# EAGLE design LoRa GPS Track v1.2 (EAGLE 7.5.0)

## Sheet 1 of 3
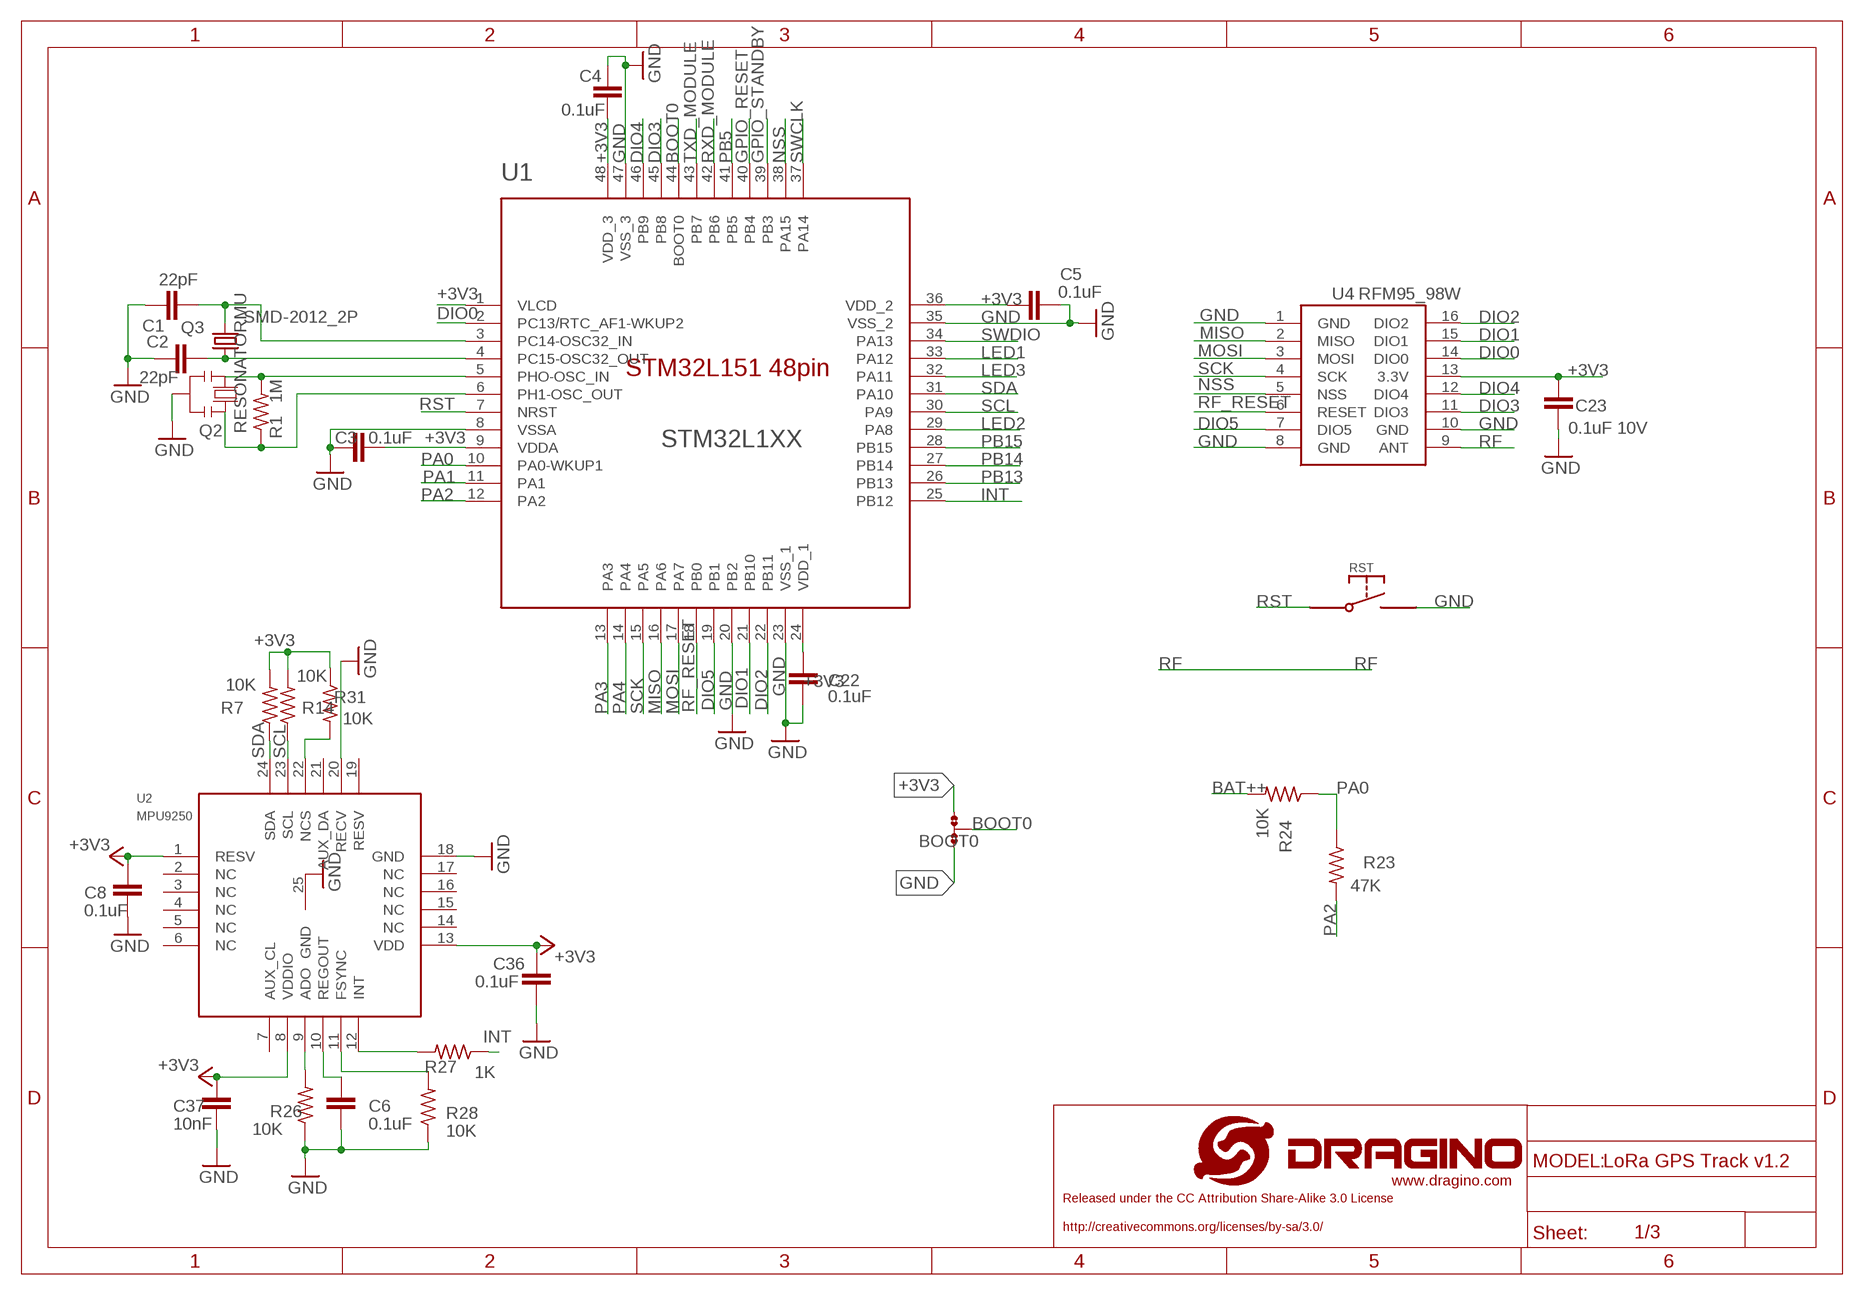
[diagram p0: schematic, sheet 1]

### Parts
BOOT0  0R-JUMPA0R-JMP-0402  [A0R-JMP-0402]
C1  22pF  C-EUC0402  [C0402]
C2  22pF  C-EUC0402  [C0402]
C3  0.1uF  C-EUC0402  [C0402]
C4  0.1uF  C-EUC0402  [C0402]
C5  0.1uF  C-EUC0402  [C0402]
C6  0.1uF  C-EUC0402  [C0402]
C8  0.1uF  C-EUC0402  [C0402]
C22  0.1uF  C-EUC0402  [C0402]
C23  0.1uF 10V  C-EUC0402  [C0402]
C36  0.1uF  C-EUC0402  [C0402]
C37  10nF  C-EUC0402  [C0402]
Q2  RESONATORMU  [RESONATOR]
Q3  SMD-2012_2P  [32.768K]
R1  1M  R-US_R0402  [R0402]
R7  10K  R-US_R0402  [R0402]
R14  10K  R-US_R0402  [R0402]
R23  47K  R-US_R0402  [R0402]
R24  10K  R-US_R0402  [R0402]
R26  10K  R-US_R0402  [R0402]
R27  1K  R-US_R0402  [R0402]
R28  10K  R-US_R0402  [R0402]
R31  10K  R-US_R0402  [R0402]
RST  SWITCHTS-017  [TS-017]
U1  STM32L1XX  [STM32L1XX]
U2  MPU9250  [QFN-24]
U4  RFM95_98W  [RFM95_98W]

### Nets
+3V3: BOOT0.1 C3.1 C4.1 C5.2 C8.2 C22.2 C23.2 C36.2 C37.2 R7.2 R14.2 R31.1 U1.1(VLCD) U1.9(VDDA) U1.24(VDD_1) U1.36(VDD_2) U1.48(VDD_3) U2.1(RESV) U2.8(VDDIO) U2.13(VDD) U4.13(3.3V) ; also sheet 2,3
BAT++: R24.2 ; also sheet 2,3
BOOT0: BOOT0.2 U1.44(BOOT0)
DIO0: U1.2(PC13/RTC_AF1-WKUP2) U4.14(DIO0)
DIO1: U1.21(PB10) U4.15(DIO1)
DIO2: U1.22(PB11) U4.16(DIO2)
DIO3: U1.45(PB8) U4.11(DIO3)
DIO4: U1.46(PB9) U4.12(DIO4)
DIO5: U1.19(PB1) U4.7(DIO5)
GND [gnd]: BOOT0.3 C1.1 C2.1 C3.2 C4.2 C5.1 C6.1 C8.1 C22.1 C23.1 C36.1 C37.1 Q2.2 R26.1 R28.1 RST.P$2 U1.8(VSSA) U1.20(PB2) U1.23(VSS_1) U1.35(VSS_2) U1.47(VSS_3) U2.18(GND) U2.20(RECV) U2.25(GND) U4.1(GND) U4.8(GND) U4.10(GND) ; also sheet 2,3
GPIO_RESET: U1.40(PB4) ; also sheet 3
GPIO_STANDBY: U1.39(PB3) ; also sheet 3
INT: R27.1 U1.25(PB12)
LED1: U1.33(PA12) ; also sheet 3
LED2: U1.29(PA8) ; also sheet 3
LED3: U1.32(PA11) ; also sheet 3
MISO: U1.16(PA6) U4.2(MISO)
MOSI: U1.17(PA7) U4.3(MOSI)
N$1: Q2.1 R1.2 U1.5(PHO-OSC_IN)
N$2: Q2.3 R1.1 U1.6(PH1-OSC_OUT)
N$9: C2.2 Q3.3 U1.4(PC15-OSC32_OUT)
N$12: C1.2 Q3.4 U1.3(PC14-OSC32_IN)
N$22: R31.2 U2.22(NCS)
N$44: R26.2 U2.9(ADO)
N$46: C6.2 U2.10(REGOUT)
N$48: R28.2 U2.11(FSYNC)
N$49: R27.2 U2.12(INT)
NSS: U1.38(PA15) U4.5(NSS)
PA0: R23.1 R24.1 U1.10(PA0-WKUP1)
PA1: U1.11(PA1)
PA2: R23.2 U1.12(PA2)
PA3: U1.13(PA3)
PA4: U1.14(PA4)
PB5: U1.41(PB5) ; also sheet 3
PB13: U1.26(PB13)
PB14: U1.27(PB14) ; also sheet 3
PB15: U1.28(PB15)
RF: U4.9(ANT)
RF_RESET: U1.18(PB0) U4.6(RESET)
RST: RST.P$1 U1.7(NRST)
RXD_MODULE: U1.42(PB6) ; also sheet 3
SCK: U1.15(PA5) U4.4(SCK)
SCL: R14.1 U1.30(PA9) U2.23(SCL)
SDA: R7.1 U1.31(PA10) U2.24(SDA)
SWCLK: U1.37(PA14) ; also sheet 2
SWDIO: U1.34(PA13) ; also sheet 2
TXD_MODULE: U1.43(PB7) ; also sheet 3
Unconnected: U2.2(NC) U2.3(NC) U2.4(NC) U2.5(NC) U2.6(NC) U2.7(AUX_CL) U2.14(NC) U2.15(NC) U2.16(NC) U2.17(NC) U2.19(RESV) U2.21(AUX_DA)

## Sheet 2 of 3
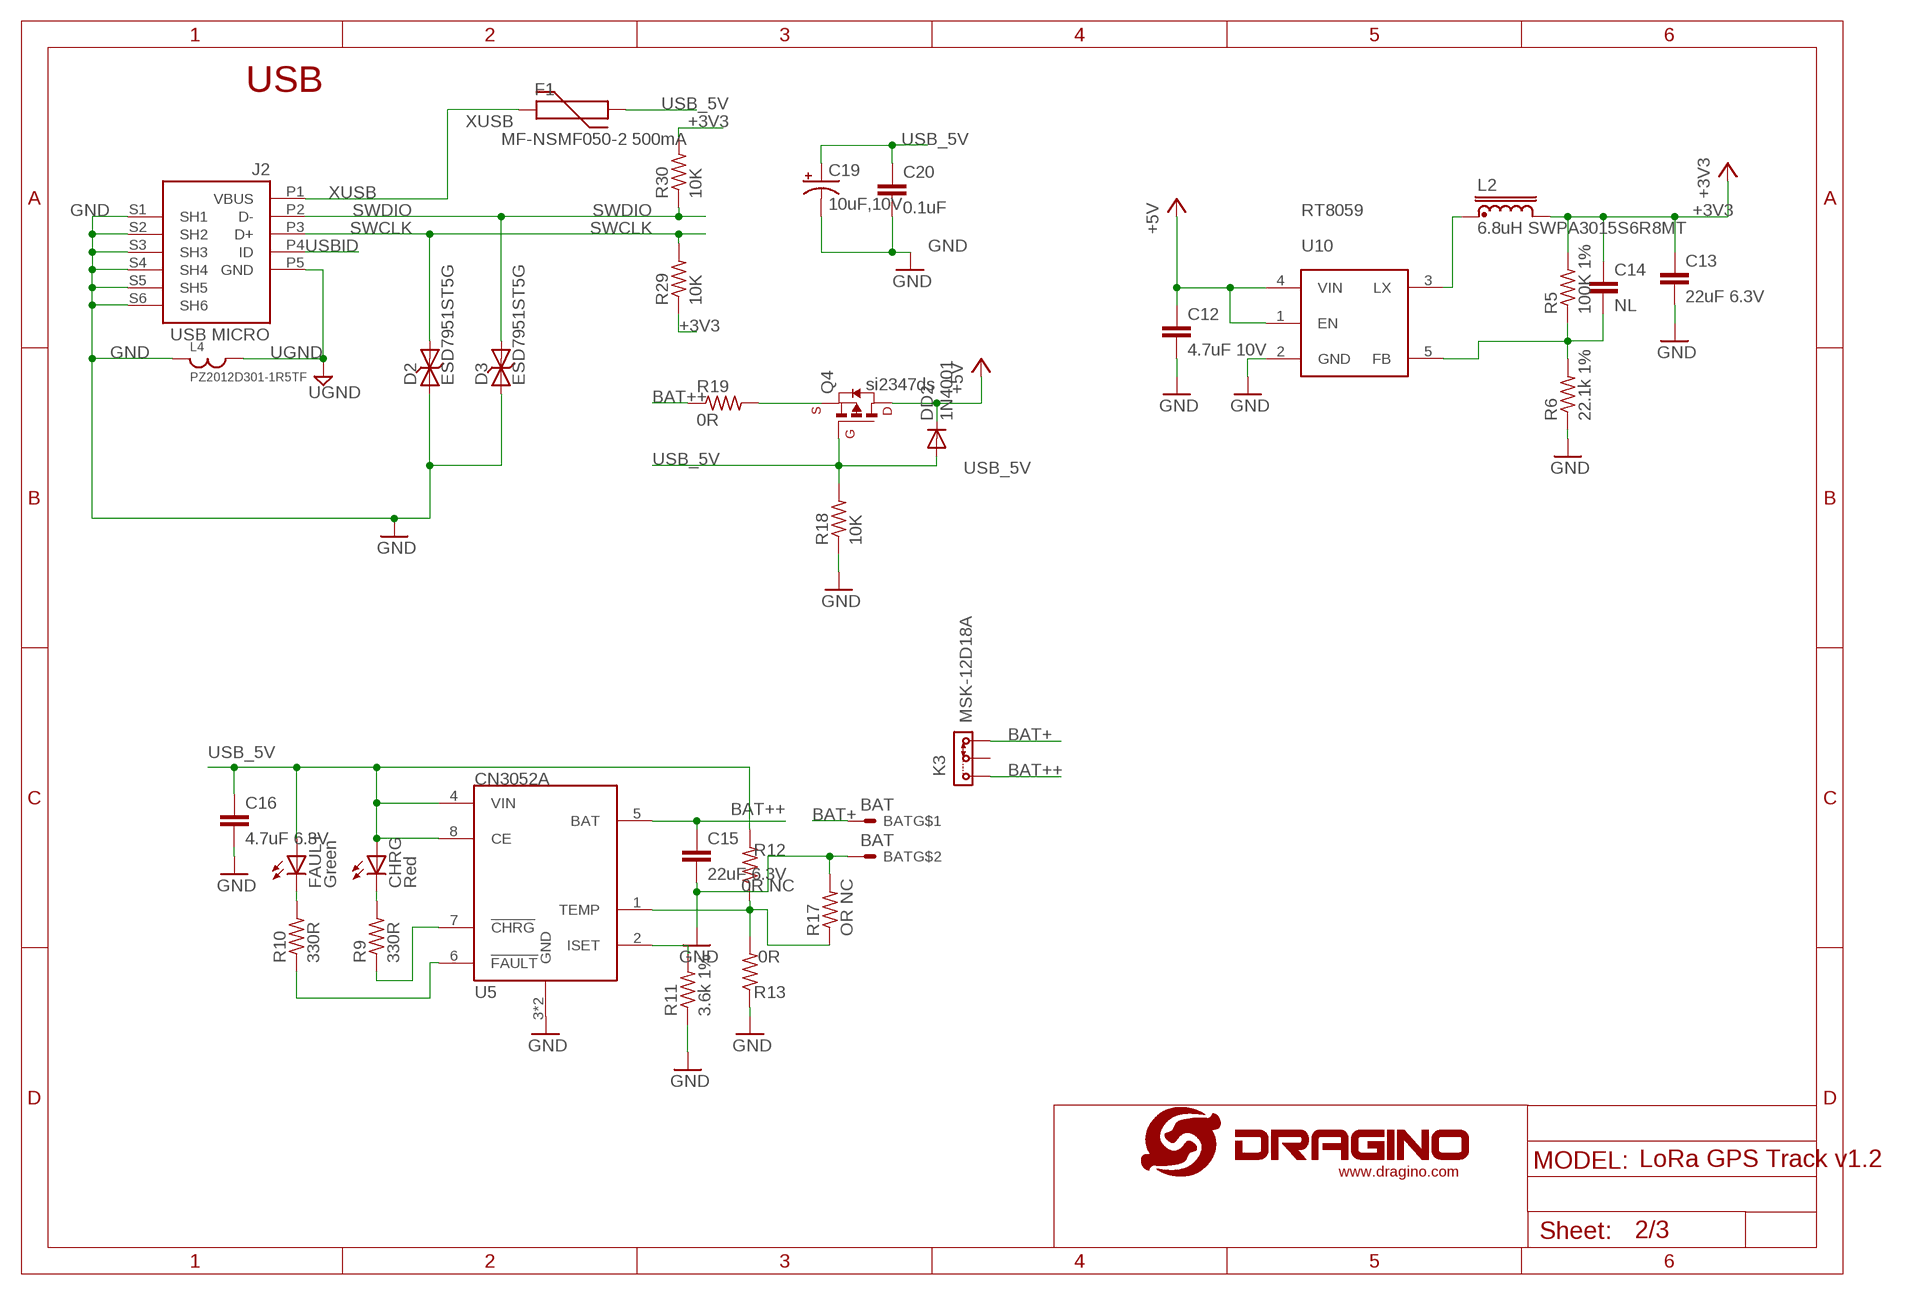
[diagram p1: schematic, sheet 2]

### Parts
BAT  BAT  [BAT]
C12  4.7uF 10V  C-EUC0402  [C0402]
C13  22uF 6.3V  C-EUC0603  [C0603]
C14  NL  C-EUC0402  [C0402]
C15  22uF 6.3V  C-EUC0603  [C0603]
C16  4.7uF 6.3V  C-EUC0603  [C0603]
C19  10uF,10V  CPOL-USSMCA  [SMC_A]
C20  0.1uF  C-EUC0402  [C0402]
CHRG  Red  DRAGINO_LEDCHIPLED_0603  [DRAGINO_CHIPLED_0603]
D2  ESD7951ST5G  TVSSOD?923  [SOD?923]
D3  ESD7951ST5G  TVSSOD?923  [SOD?923]
DD2  1N4001  DIODEDO214AC  [DIODE_DO214AC]
F1  MF-NSMF050-2 500mA  FUSE1206  [R1206$1]
FAULT  Green  DRAGINO_LEDCHIPLED_0603  [DRAGINO_CHIPLED_0603]
J2  USB MICRO  MYCON2_USB-MINI-B  [CON2_USB_MICRO_B_AT]
K3  MSK-12D18A  [MSK-12D18A]
L2  6.8uH SWPA3015S6R8MT  INDUCTORSWPA3010S  [SWPA3010S]
L4  PZ2012D301-1R5TF  BEADS0805  [C0805$1]
Q4  si2347ds  P-MOSFET_HP  [SOT-23-HIGH-POWER]
R5  100K 1%  R-US_R0402  [R0402]
R6  22.1k 1%  R-US_R0402  [R0402]
R9  330R  R-US_R0402  [R0402]
R10  330R  R-US_R0402  [R0402]
R11  3.6k 1%  R-US_R0402  [R0402]
R12  0R NC  R-US_R0402  [R0402]
R13  0R  R-US_R0402  [R0402]
R17  OR NC  R-US_R0402  [R0402]
R18  10K  R-US_R0402  [R0402]
R19  0R  R-US_R0805  [R0805]
R29  10K  R-US_R0402  [R0402]
R30  10K  R-US_R0402  [R0402]
U5  CN3052A  [CN3052A]
U10  RT8059  [SOT23-5]

### Nets
+3V3: C13.1 C14.1 L2.P$2 R5.2 R29.1 R30.2 ; also sheet 1,3
+5V: C12.1 DD2.C Q4.1(D) U10.1(EN) U10.4(VIN)
BAT+: BAT.P$1 K3.3
BAT++: C15.1 K3.1 R19.1 U5.5(BAT) ; also sheet 1,3
GND [gnd]: BAT.P$2 C12.2 C13.2 C15.2 C16.2 C19.- C20.2 D2.P$1 D3.P$1 J2.S1(SH1) J2.S2(SH2) J2.S3(SH3) J2.S4(SH4) J2.S5(SH5) J2.S6(SH6) L4.1 R6.1 R11.1 R13.1 R17.2 R18.1 U5.3(GND) U5.P$1(GND) U10.2(GND) ; also sheet 1,3
N$4: CHRG.C R9.2
N$5: L2.P$1 U10.3(LX)
N$7: FAULT.C R10.2
N$8: Q4.2(S) R19.2
N$10: R9.1 U5.7(!CHRG)
N$11: R10.1 U5.6(!FAULT)
N$15: R12.1 R13.2 R17.1 U5.1(TEMP)
N$16: R11.2 U5.2(ISET)
N$20: C14.2 R5.1 R6.2 U10.5(FB)
SWCLK: D2.P$2 J2.P3(D+) R29.2 ; also sheet 1
SWDIO: D3.P$2 J2.P2(D-) R30.1 ; also sheet 1
UGND [gnd]: J2.P5(GND) L4.2
USB_5V: C16.1 C19.+ C20.1 CHRG.A DD2.A F1.1 FAULT.A Q4.3(G) R12.2 R18.2 U5.4(VIN) U5.8(CE)
USBID: J2.P4(ID)
XUSB [usbvcc]: F1.2 J2.P1(VBUS)
Unconnected: K3.2

### Notes on the sheet
- USB

## Sheet 3 of 3
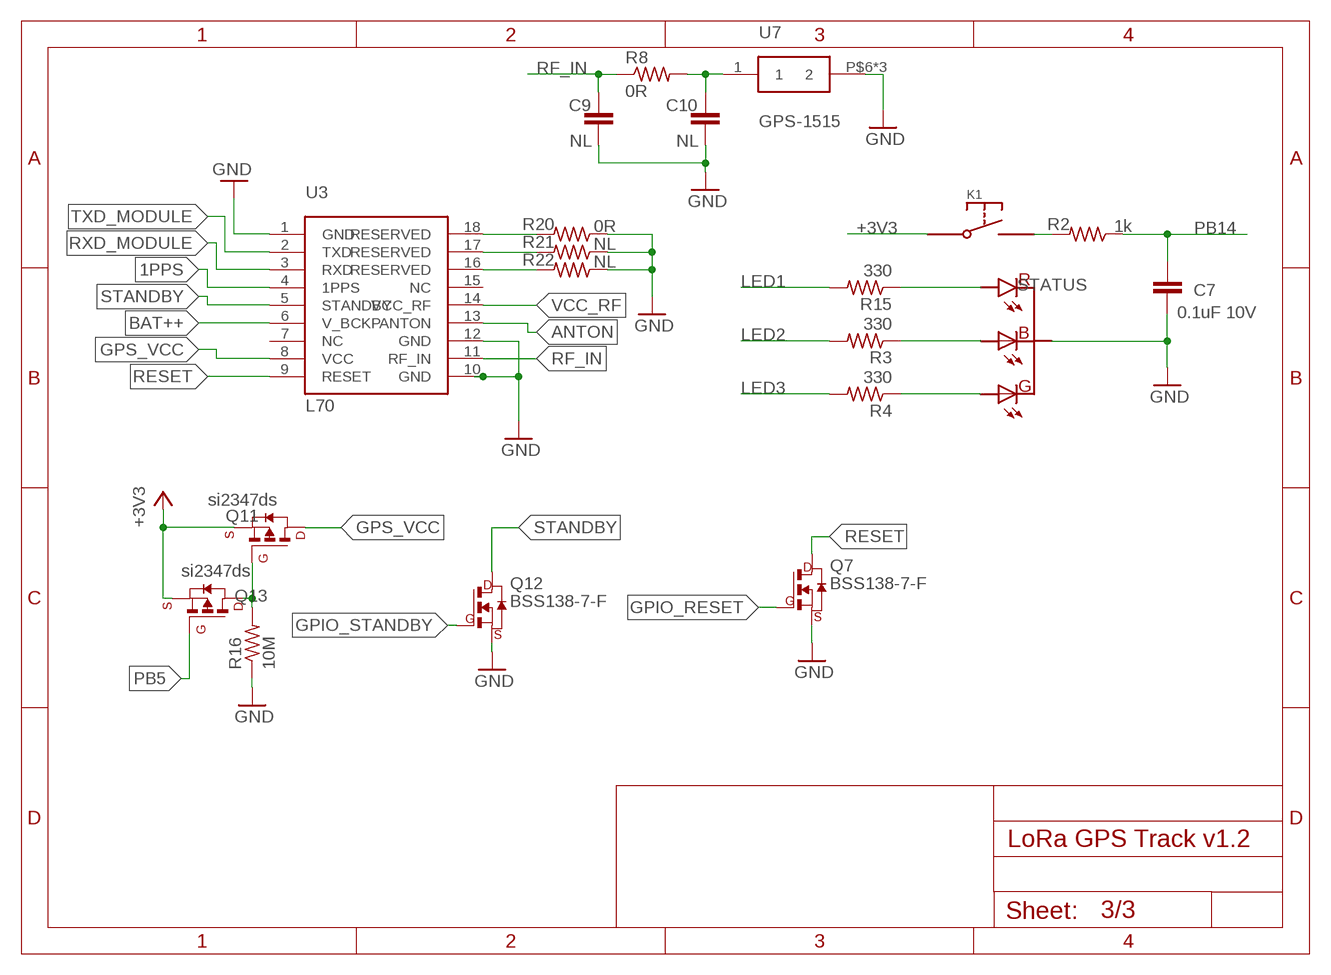
[diagram p2: schematic, sheet 3]

### Parts
C7  0.1uF 10V  C-EUC0402  [C0402]
C9  NL  C-EUC0402  [C0402]
C10  NL  C-EUC0402  [C0402]
K1  S-LAY  [KEY]
Q7  BSS138-7-F  NMOSFET  [SOT-23]
Q11  si2347ds  P-MOSFET_HP  [SOT-23-HIGH-POWER]
Q12  BSS138-7-F  NMOSFET  [SOT-23]
Q13  si2347ds  P-MOSFET_HP  [SOT-23-HIGH-POWER]
R2  1k  R-US_R0402  [R0402]
R3  330  R-US_R0402  [R0402]
R4  330  R-US_R0402  [R0402]
R8  0R  R-US_R0402  [R0402]
R15  330  R-US_R0402  [R0402]
R16  10M  R-US_R0402  [R0402]
R20  0R  R-US_R0402  [R0402]
R21  NL  R-US_R0402  [R0402]
R22  NL  R-US_R0402  [R0402]
STATUS  LED-RGB-THR-5MM-GNDSMD-3528  [LED-3528]
U3  L70  [L70]
U7  GPS-1515  [GPS-15*15]

### Nets
1PPS: U3.4(1PPS)
+3V3: K1.1 K1.2 K1.5 Q11.2(S) Q13.2(S) ; also sheet 1,2
ANTON: U3.13(ANTON)
BAT++: U3.6(V_BCKP) ; also sheet 1,2
GND [gnd]: C7.1 C9.2 C10.2 Q7.2(S) Q12.2(S) R16.1 R20.1 R21.1 R22.1 STATUS.+(C) U3.1(GND) U3.10(GND) U3.12(GND) U7.P$6 U7.P$7 U7.P$8 ; also sheet 1,2
GPIO_RESET: Q7.3(G) ; also sheet 1
GPIO_STANDBY: Q12.3(G) ; also sheet 1
GPS_VCC: Q11.1(D) U3.8(VCC)
LED1: R15.2 ; also sheet 1
LED2: R3.2 ; also sheet 1
LED3: R4.2 ; also sheet 1
N$6: R15.1 STATUS.R-
N$14: Q11.3(G) Q13.1(D) R16.2
N$17: K1.3 K1.4 K1.6 R2.2
N$18: R3.1 STATUS.B-
N$19: R4.1 STATUS.G-
N$21: C10.1 R8.2 U7.1
N$37: R20.2 U3.18(RESERVED)
N$38: R21.2 U3.17(RESERVED)
N$39: R22.2 U3.16(RESERVED)
PB5: Q13.3(G) ; also sheet 1
PB14: C7.2 R2.1 ; also sheet 1
RESET: Q7.1(D) U3.9(RESET)
RF_IN: C9.1 R8.1 U3.11(RF_IN)
RXD_MODULE: U3.3(RXD) ; also sheet 1
STANDBY: Q12.1(D) U3.5(STANDBY)
TXD_MODULE: U3.2(TXD) ; also sheet 1
VCC_RF: U3.14(VCC_RF)
Unconnected: U3.7(NC) U3.15(NC)

## Library data of the parts
BAT = dragino-passive:BAT
BOOT0 = dragino:0R-JUMP: SMD 0R 0805 Jumper
C1-C5 C7 C9 C10 C20 C22 C23 = dragino-passive:C-EU: CAPACITOR, European symbol
C6 C8 C12-C16 C36 C37 = dragino:C-EU: CAPACITOR, European symbol
C19 = rcl:CPOL-US: POLARIZED CAPACITOR, American symbol
CHRG FAULT = Lora Shield v1.1.1:DRAGINO_LED: LED OSRAM: - CHIPLED LG R971, LG N971, LY N971, LG Q971, LY Q971, LO R971, LY R971 LH N974, LH R974 LS Q976, LO Q976, LY Q976 LO Q996 - Hyper CHIPLED LW Q18S LB Q993, LB Q99A, LB R99A - SideLED LS A670, LO A670, LY A670, LG A670, LP A670 LB A673, LV A673, LT A673, LW A673 LH A674 LY A675 LS A676, LA A676, LO A676, LY A676, LW A676 LS A679, LY A679, LG A679 - Hyper Micro SIDELED? LS Y876, LA Y876, LO Y876, LY Y876 LT Y87S - SmartLED LW L88C, LW L88S LB L89C, LB L89S, LG L890 LS L89K, LO L89K, LY L89K LS L896, LA L896, LO L896, LY L896 - TOPLED LS T670, LO T670, LY T670, LG T670, LP T670 LSG T670, LSP T670, LSY T670, LOP T670, LYG T670 LG T671, LOG T671, LSG T671 LB T673, LV T673, LT T673, LW T673 LH T674 LS T676, LA T676, LO T676, LY T676, LB T676, LH T676, LSB T676, LW T676 LB T67C, LV T67C, LT T67C, LS T67K, LO T67K, LY T67K, LW E67C LS E67B, LA E67B, LO E67B, LY E67B, LB E67C, LV E67C, LT E67C LW T67C LS T679, LY T679, LG T679 LS T770, LO T770, LY T770, LG T770, LP T770 LB T773, LV T773, LT T773, LW T773 LH T774 LS E675, LA E675, LY E675, LS T675 LS T776, LA T776, LO T776, LY T776, LB T776 LHGB T686 LT T68C, LB T68C - Hyper Mini TOPLED? LB M676 - Mini TOPLED Santana? LG M470 LS M47K, LO M47K, LY M47K Source: http://www.osram.convergy.de LUXEON: - LUMILED? LXK2-PW12-R00, LXK2-PW12-S00, LXK2-PW14-U00, LXK2-PW14-V00 LXK2-PM12-R00, LXK2-PM12-S00, LXK2-PM14-U00 LXK2-PE12-Q00, LXK2-PE12-R00, LXK2-PE12-S00, LXK2-PE14-T00, LXK2-PE14-U00 LXK2-PB12-K00, LXK2-PB12-L00, LXK2-PB12-M00, LXK2-PB14-N00, LXK2-PB14-P00, LXK2-PB14-Q00 LXK2-PR12-L00, LXK2-PR12-M00, LXK2-PR14-Q00, LXK2-PR14-R00 LXK2-PD12-Q00, LXK2-PD12-R00, LXK2-PD12-S00 LXK2-PH12-R00, LXK2-PH12-S00 LXK2-PL12-P00, LXK2-PL12-Q00, LXK2-PL12-R00 Source: www.luxeon.com KINGBRIGHT: KA-3528ASYC Source: www.kingbright.com
D2 D3 = dragino:TVS: DIODE
DD2 = dragino:DIODE: DIODE
F1 = dragino:FUSE: FUSE 5 x 20 mm
J2 = SmartPrj:MYCON2_USB-MINI-B
K1 = dragino:S-LAY
K3 = dragino1:MSK-12D18A
L2 = dragino:INDUCTOR: CHOKE U15
L4 = dragino:BEADS
Q2 = SmartPrj:RESONATOR
Q3 = crystal:SMD-2012_2P: kHz RANGE CRYSTAL UNIT SMD Source: MC-306_405_406_E07X.PDF Homepage <http://www.epsontoyocom.co.jp>
Q4 Q11 Q13 = dragino:P-MOSFET
Q7 Q12 = dragino:NMOSFET: MOS FET; OC_FARNELL: unknown; OC_NEWARK: unknown
R1-R24 R26-R31 = dragino:R-US_: RESISTOR, American symbol
RST = dragino:SWITCH
STATUS = dragino:LED-RGB-THR-5MM-GND: DUO LED 2 colors (red/green), 5 mm, round, common Anode www.ligitek.com or other producers.
U1 = dragino:STM32L1XX
U2 = dragino:MPU9250
U3 = dragino:L70
U4 = dragino:RFM95_98W
U5 = 328PAU:CN3052A
U7 = dragino:GPS-15*15
U10 = dragino:RT8059

## Net classes
0 default: width 0.203 mm, clearance 0.203 mm
1 2layer_50ohm: width 1.001 mm, clearance 0.2 mm
2 gnd: width 0.305 mm, drill 0.33 mm, clearance 0.254 mm
3 usbvcc: width 0.203 mm, drill 0.33 mm, clearance 0.254 mm

## Board
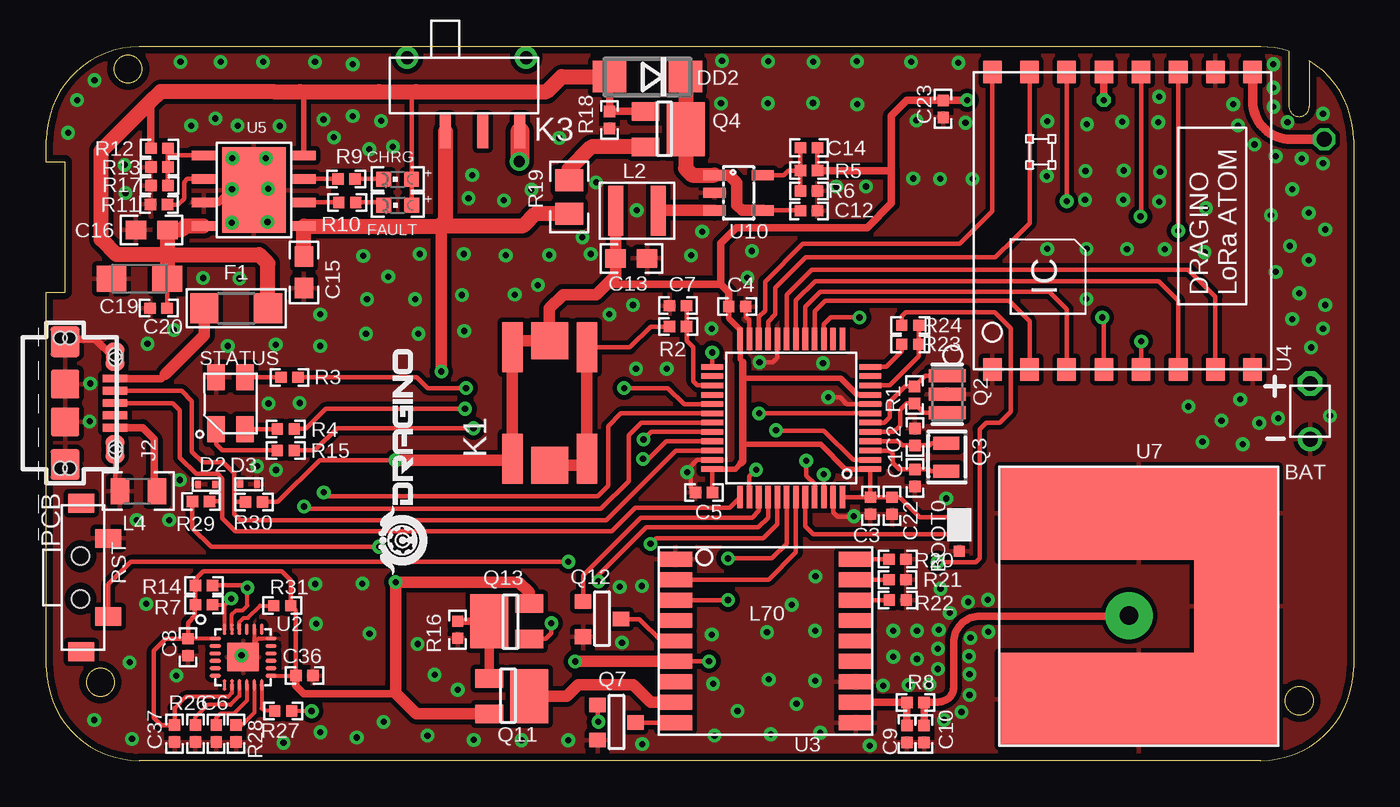
[diagram p3: board, top side]
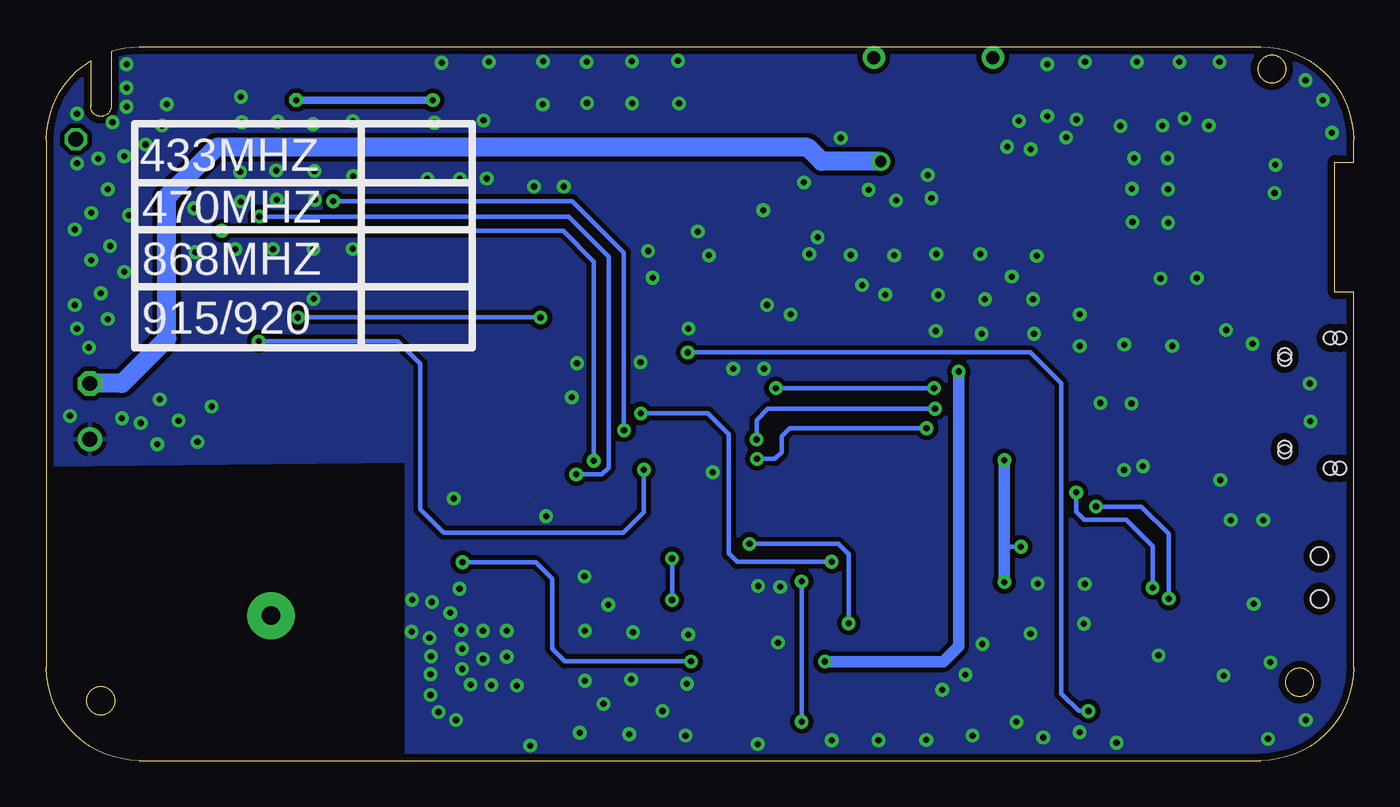
[diagram p4: board, bottom side, seen from below]

Size 70.33 x 38.4 mm. Coordinates in mm from the lower left corner, seen from the top.
Outline: 65.33,0 5,0 arc-90 0,5 0,25.2 1,25.2 1,32.2 0,32.2 0,33.4 arc-90 5,38.4 65.33,38.4 arc-18 66.85,38.16 66.85,35.2 arc180 67.95,35.2 67.95,37.66 arc-58 70.33,33.4 70.33,5 arc-90 65.33,0
Outline: circle at 4.39,37.21 radius 0.75
Outline: circle at 2.9,4.21 radius 0.75
Outline: circle at 67.4,3.21 radius 0.75
Copper layers (1*16): Top 0.035mm / dielectric 1.5mm / Bottom 0.035mm
Design rules "default *": minimum track width 6mil, minimum drill 10mil, track to track 6mil, track to pad 10mil, pad to pad 6mil, via to via 6mil, smd to smd 6mil, copper to edge 15mil, drill to drill 8mil, minimum pad ring 10mil, minimum via ring 8mil, stop-mask expansion 4mil, vias tented up to drill 30mil, thermal gap 10mil

### Footprints (pad centres in the part's own frame; a part is rotated, then mirrored left to right if it is on the bottom)
BAT = drill 0.8 octagon: P$1 0,1.5 | drill 0.8: P$2 0,-1.5
A0R-JMP-0402 = smd 0.61 x 0.61: 1 0,0.914; 2 0,0; 3 0,-0.914
C0402 = smd 0.61 x 0.61: 1 -0.457,0; 2 0.457,0
C0603 = smd 1.1 x 1: 1 -0.85,0; 2 0.85,0
SMC_A = smd 1.6 x 1.4: + -1.5,0; - 1.5,0
DRAGINO_CHIPLED_0603 = smd 0.8 x 0.8: A 0,-0.75; C 0,0.75
SOD?923 = smd 0.3 x 0.4: P$1 -0.45,0; P$2 0.45,0
DIODE_DO214AC = smd 1.8 x 1.7: A 2.05,0; C -2.05,0
R1206$1 = smd 1.52 x 1.6: 1 -1.71,0; 2 1.71,0
CON2_USB_MICRO_B_AT = smd 0.406 x 1.346: P1 -1.321,2.692; P2 -0.66,2.692; P3 0,2.692; P4 0.66,2.692; P5 1.321,2.692 | smd 1.651 x 1.549: S1 -3.302,0; S2 3.302,0 | smd 1.524 x 1.016: S3 -2.489,2.692; S4 2.489,2.692 | smd 1.524 x 1.524: S5 -1.016,0; S6 1.016,0 | hole 0.7: -3.505,0.254; -3.505,-0.254; 3.505,0.254; 3.505,-0.254; -2.616,2.692; -2.362,2.692; 2.362,2.692; 2.616,2.692
KEY = smd 2.7 x 1.1: 1 -3,2; 2 3,2; 3 3,-2; 4 -3,-2 | smd 2 x 2: 5 3.35,0; 6 -3.35,0
MSK-12D18A = smd 0.6 x 1.8: 1 -2,-0.152; 2 0,-0.152; 3 2,-0.152 | drill 0.7: P$1 -4.06,3.81; P$2 2.34,3.81
SWPA3010S = smd 0.8 x 2.7: P$1 -1.15,0; P$2 1.15,0
C0805$1 = smd 1 x 1.4: 1 -1,0; 2 1,0
RESONATOR = smd 0.7 x 2: 1 -1,0; 2 0,0; 3 1,0
32.768K = smd 0.7 x 1.4: 3 0.78,0.03; 4 -0.72,0.03
SOT-23-HIGH-POWER = smd 2.9 x 2.05: 1 0,-1.143 | smd 1 x 1.5: 2 -0.95,1.016; 3 0.95,1.016
SOT-23 = smd 0.787 x 0.889: 1 0,-1.016; 2 -0.95,1.016; 3 0.95,1.016
R0402 = smd 0.61 x 0.61: 1 -0.457,0; 2 0.457,0
R0805 = smd 1.2 x 1.5: 1 -0.9,0; 2 0.9,0
TS-017 = smd 1 x 1.4: P$1 -2.1,-1.5; P$2 2.1,-1.5; P$3 -3.994,-0.034; P$4 3.994,-0.034 | hole 0.95: -1.15,0; 1.15,0
LED-3528 = smd 1.4 x 0.95: + -1.4,-0.775; B- -1.4,0.775; G- 1.4,0.775; R- 1.4,-0.775
STM32L1XX = smd 1.2 x 0.3: 1 -4.25,2.75; 2 -4.25,2.25; 3 -4.25,1.75; 4 -4.25,1.25; 5 -4.25,0.75; 6 -4.25,0.25; 7 -4.25,-0.25; 8 -4.25,-0.75; 9 -4.25,-1.25; 10 -4.25,-1.75; 11 -4.25,-2.25; 12 -4.25,-2.75; 25 4.25,-2.75; 26 4.25,-2.25; 27 4.25,-1.75; 28 4.25,-1.25; 29 4.25,-0.75; 30 4.25,-0.25; 31 4.25,0.25; 32 4.25,0.75; 33 4.25,1.25; 34 4.25,1.75; 35 4.25,2.25; 36 4.25,2.75 | smd 0.3 x 1.2: 13 -2.75,-4.25; 14 -2.25,-4.25; 15 -1.75,-4.25; 16 -1.25,-4.25; 17 -0.75,-4.25; 18 -0.25,-4.25; 19 0.25,-4.25; 20 0.75,-4.25; 21 1.25,-4.25; 22 1.75,-4.25; 23 2.25,-4.25; 24 2.75,-4.25; 37 2.75,4.25; 38 2.25,4.25; 39 1.75,4.25; 40 1.25,4.25; 41 0.75,4.25; 42 0.25,4.25; 43 -0.25,4.25; 44 -0.75,4.25; 45 -1.25,4.25; 46 -1.75,4.25; 47 -2.25,4.25; 48 -2.75,4.25
QFN-24 = smd 0.6 x 0.2: 1 -1.5,1; 2 -1.5,0.6; 3 -1.5,0.2; 4 -1.5,-0.2; 5 -1.5,-0.6; 6 -1.5,-1; 13 1.5,-1; 14 1.5,-0.6; 15 1.5,-0.2; 16 1.5,0.2; 17 1.5,0.6; 18 1.5,1 | smd 0.2 x 0.6: 7 -1,-1.5; 8 -0.6,-1.5; 9 -0.2,-1.5; 10 0.2,-1.5; 11 0.6,-1.5; 12 1,-1.5; 19 1,1.5; 20 0.6,1.5; 21 0.2,1.5; 22 -0.2,1.5; 23 -0.6,1.5; 24 -1,1.5 | smd 1.7 x 1.54: 25 0,0
L70 = smd 1.8 x 0.8: 1 4.85,-4.4; 2 4.85,-3.3; 3 4.85,-2.2; 4 4.85,-1.1; 5 4.85,0; 6 4.85,1.1; 7 4.85,2.2; 8 4.85,3.3; 9 4.85,4.4; 10 -4.85,4.4; 11 -4.85,3.3; 12 -4.85,2.2; 13 -4.85,1.1; 14 -4.85,0; 15 -4.85,-1.1; 16 -4.85,-2.2; 17 -4.85,-3.3; 18 -4.85,-4.4
RFM95_98W = smd 1.2 x 1: 1 -8,5.73; 2 -8,3.73; 3 -8,1.73; 4 -8,-0.27; 5 -8,-2.27; 6 -8,-4.27; 7 -8,-6.27; 8 -8,-8.27; 9 8,-8.27; 10 8,-6.27; 11 8,-4.27; 12 8,-2.27; 13 8,-0.27; 14 8,1.73; 15 8,3.73; 16 8,5.73
CN3052A = smd 1.27 x 0.51: 1 -2.71,1.87; 2 -2.71,0.6; 3 -2.71,-0.67; 4 -2.71,-1.94; 5 2.69,-1.94; 6 2.69,-0.67; 7 2.69,0.6; 8 2.69,1.87 | smd 3.4 x 4.6: P$1 0,0
GPS-15*15 = drill 1 pad 2.54: 1 0.52,0.5 | smd 4.5 x 5: P$6 -5.25,0 | smd 15 x 5: P$7 0,-5; P$8 0,5
SOT23-5 = smd 0.55 x 1.2: 1 -0.95,-1.3; 2 0,-1.3; 3 0.95,-1.3; 4 0.95,1.3; 5 -0.95,1.3

### Placement (x,y rotation side)
BAT  67.99,18.78 0 top
BOOT0  49.11,12.18 0 top
C1  46.73,15.2 90 top
C2  46.73,17.41 270 top
C3  44.33,13.7 270 top
C4  37.17,24.42 0 top
C5  35.38,14.43 0 top
C6  9.13,1.45 90 top
C7  33.98,24.47 0 top
C8  7.61,6.09 90 top
C9  46.3,1.43 270 top
C10  47.22,1.43 270 top
C12  41.02,29.58 0 top
C13  31.47,27.02 0 top
C14  41.02,32.97 180 top
C15  13.85,26.27 270 top
C16  5.66,28.55 180 top
C19  4.99,25.93 180 top
C20  6.04,24.34 180 top
C22  45.5,13.7 90 top
C23  48.25,35.06 90 top
C36  13.88,4.57 180 top
C37  6.9,1.45 90 top
CHRG  18.89,31.28 90 top
D2  8.61,14.86 0 top
D3  10.88,14.87 180 top
DD2  32.34,36.8 180 top
F1  10.2,24.33 180 top
FAULT  18.9,29.88 90 top
J2  1,19.23 270 top
K1  27.07,19.24 90 top
K3  23.46,34.01 0 top
L2  31.78,29.58 180 top
L4  4.95,14.5 0 top
Q2  48.47,19.71 90 top
Q3  48.44,16.28 90 top
Q4  33.25,33.97 90 top
Q7  30.67,2.04 90 top
Q11  24.83,3.46 90 top
Q12  29.89,7.61 90 top
Q13  24.97,7.5 270 top
R1  46.7,19.67 270 top
R2  33.99,23.35 180 top
R3  13.07,20.62 0 top
R4  12.87,17.84 0 top
R5  41.02,31.74 0 top
R6  41.02,30.65 180 top
R7  8.47,8.38 180 top
R8  46.76,3.13 0 top
R9  16.14,31.29 0 top
R10  16.18,30.03 0 top
R11  6.06,29.92 0 top
R12  6.08,32.94 180 top
R13  6.08,31.93 0 top
R14  8.47,9.42 180 top
R15  12.87,16.69 0 top
R16  22.13,7.04 90 top
R17  6.08,30.94 180 top
R18  30.29,34.47 90 top
R19  28.12,30.32 90 top
R20  45.8,10.83 180 top
R21  45.79,9.73 180 top
R22  45.8,8.64 180 top
R23  46.47,22.4 180 top
R24  46.47,23.42 180 top
R26  8.02,1.45 90 top
R27  12.74,2.67 180 top
R28  10.2,1.45 90 top
R29  8.31,13.94 0 top
R30  11.17,13.91 0 top
R31  12.69,8.33 180 top
RST  1.83,9.85 90 top
STATUS  9.9,19.22 270 top
U1  40.07,18.43 180 top
U2  10.58,5.56 0 top
U3  38.69,6.43 180 top
U4  56.62,29.04 90 top
U5  11.16,30.69 0 top
U7  58.77,8.29 180 top
U10  37.24,30.54 270 top
U$1  [LOGO-DRAGINO-2018]  20.49,10.01 90 top

### Tracks (layer width: path | path; a pad name or v marks a point on that pad's centre or on a via)
+3V3  (via drill 0.33)  (1 unrouted)
  Top 0.203: U2.8 9.98,3.64 9.77,3.43 7.51,3.43 6.9,2.82 | U2.13 13.42,4.56 C36.2 | U2.1 C8.2
  Top 0.254: C14.1 R5.2 | C5.2 U1.36 | U1.48 44.31,14.18 | U1.1 C3.1 C22.2 45.9,14.16 46.97,13.09 BOOT0.1 | 26.69,22.24 arc90 26.68,22.23 | C36.2 13.4,4.6 13.4,8.08 R31.1 13.15,9.7 12.66,10.18 8.45,10.18 8.02,9.75 R14.2 R7.2 7.99,8.36 7.99,7.8 7.62,7.43 C8.2 | C8.2 6.41,6.55 5.78,5.92 5.78,2.31 6.19,1.9 C37.2 6.9,2.82 | R30.2 12.45,13.91 14.7,16.15 v18.78,16.15 | R29.1 7.86,12.5 8.85,11.51 v17.9,11.51
  Top 0.305: C4.1 36.71,23.79 37.32,23.17 U1.24 37.32,21.58 37.47,21.44 | U1.36 37.06,15.68 37.39,16.02 | U1.9 43.61,19.68 42.72,20.57 37.62,20.57 37.47,20.72 | U1.1 42.98,15.68 41.65,17.01 37.52,17.01 37.47,17.06
  Top 0.406: 37.47,21.44 37.47,20.72 37.47,17.06 37.47,16.1 37.39,16.02 | C4.1 36.71,25.2 36.29,25.63 36.18,25.63 | 36.18,25.63 30.34,25.63 30.24,25.73 | 45.46,31.77 45.46,29.97 44.16,28.68 37.12,28.68 36.29,27.84 36.29,25.73 36.18,25.63 | R5.2 45.42,31.74 45.46,31.77 | U4.13 v56.89,35.54 v56.88,35.53 | v49.54,35.53 48.26,35.53 C23.2 46.28,35.52 45.46,34.7 45.46,31.77 | 13.42,4.56 13.42,4.02 13.83,3.61 18.76,3.61 18.78,3.63 | 18.73,4.24 18.78,4.19 | K1.5 26.69,22.59 26.69,22.24
  Top 0.61: L2.P$2 C13.1 30.62,26.11 30.24,25.73 29.58,25.07 27.8,25.07 27.07,24.33 K1.5 25.42,22.59 K1.2 K1.1 24.99,16.15 v18.78,16.15 | Q13.2 25.97,9.04 25.41,9.6 v18.78,9.6 18.78,4.19 18.78,3.63 19.9,2.51 Q11.2
  Bottom 0.254: v17.9,11.51 18.66,11.51 18.78,11.63
  Bottom 0.406: v56.88,35.53 v49.54,35.53
  Bottom 0.61: v18.78,16.15 18.78,11.63 v18.78,9.6
+5V
  Top 0.254: U10.4 40.55,29.59 C12.1
  Top 0.61: U10.1 36.73,31.49 37.15,31.08 37.15,29.88 37.44,29.59 U10.4
  Top 0.813: DD2.C 34.39,33.99 | 34.39,33.99 34.39,31.85 34.74,31.5 U10.1 | Q4.1 34.39,33.98 34.39,33.99
BAT+  (via drill 0.6)
  Top 1.016: K3.3 25.46,32.26 v25.44,32.23
  Bottom 1.016: v25.44,32.23 28.61,32.23 29.38,32.99 61.18,32.99 63.68,30.49 63.79,30.38 63.84,30.33 63.84,22.71 66.26,20.29 67.98,20.29 BAT.P$1
BAT++  (via drill 0.33)
  Top 0.254: R24.2 46.01,23.9 46.24,24.13 51.02,24.13 51.88,23.27 51.88,18.77 51.3,18.19 50.56,18.19 50.2,17.83 50.2,10.87 50,10.67 v47.94,10.67 | U3.6 v35.65,5.33
  Top 0.305: 21.25,28.65 21.12,28.78
  Top 0.61: v21.25,20.93 21.25,28.65 | U3.6 v28.45,5.33 v28.44,5.33
  Top 0.813: C15.1 U5.5 | U5.5 | 21.63,28.78 21.12,28.78 21.1,28.75 U5.5 | 21.63,28.78 25.67,28.78 26.33,29.44 28.1,29.44 R19.1 | K3.1 21.46,28.94 21.63,28.78
  Bottom 0.254: v35.65,5.33 42.43,5.33 43.12,6.02 43.12,9.78 44.01,10.67 v47.94,10.67
  Bottom 0.305: 21.25,5.94 21.25,6.15
  Bottom 0.61: v21.25,20.93 21.25,6.15 22.07,5.33 v28.44,5.33
BOOT0
  Top 0.254: BOOT0.2 41.25,12.18 40.82,12.6 U1.44
DIO0  (via drill 0.33)
  Top 0.254: U1.2 43.41,16.18 41.83,17.76 v39.26,17.76 v39.25,17.77 | U4.14 v54.89,30.09
  Bottom 0.254: v39.25,17.77 39.25,27.33 42.03,30.1 54.88,30.1 v54.89,30.09
DIO1
  Top 0.254: U1.21 38.82,23.61 39.22,24.01 39.22,25.45 40.84,27.07 51.06,27.07 52.08,28.09 52.8,28.8 52.89,28.9 U4.15
DIO2
  Top 0.254: U1.22 38.32,23.87 38.66,24.21 38.66,25.77 40.69,27.8 49.15,27.8 50.89,29.54 U4.16
DIO3  (via drill 0.33)
  Top 0.254: U1.45 41.32,14.88 40.88,15.33 v40.88,16.13 | U4.11 v60.89,28.5
  Bottom 0.254: v40.88,16.13 40.88,26.85 42.53,28.5 v60.89,28.5
DIO4  (via drill 0.33)
  Top 0.254: U1.46 v41.82,15.39 v41.82,15.4 | U4.12 58.89,29.29 v58.87,29.27
  Bottom 0.254: v41.82,15.39 40.45,15.39 40.08,15.77 40.08,27.11 42.24,29.27 v58.87,29.27
DIO5
  Top 0.254: U1.19 39.82,25.05 41.18,26.4 61.44,26.4 62.89,24.95 U4.7
GND  (via drill 0.33)
  Top 0.203: U2.20 11.18,6.34 | 11.18,6.34 v10.49,5.66 | U2.18 11.4,6.56 11.18,6.34
  Top 0.254: U1.23 37.82,23.69 37.62,23.89 C4.2 | U1.8 43.07,19.18 42.7,19.55 v42.06,19.55 | U1.47 42.32,13.37 42.58,13.12 43.41,13.12 v43.44,13.14 | U1.35 35.01,16.18 34.67,15.85 34.67,14.67 C5.1 | U1.20 39.32,21.68 39.08,21.44 v38.37,21.44 v38.36,21.43 | J2.S4 3.69,14.9 L4.1
  Top 0.406: J2.S3 3.59,21.72 2.63,22.68 1.6,22.68 | U5.3 9.27,30.02 v9.98,30.73
  other vias: 44.29,0.8 34.47,15.51 37.71,25.98 34.68,27.18 31.76,29.61 4.2,32.05 4.25,30.53 11.92,30.76 9.97,28.93 11.89,28.97 37.95,27.42 60.17,27.51 53.84,27.53 55.96,27.53 58.13,27.52 55.95,24.84 17.38,6.83 5.43,22.43 28.83,28.16 29.57,31.11 26.09,30.71 35.28,28.46 36.29,35.36 36.34,37.65 38.83,37.62 2.35,20.29 2.32,18.25 27.59,33.5 38.82,35.36 24.61,30.14 30.29,24 31.56,24.51 41.26,37.59 41.24,35.38 43.63,35.3 43.6,37.62 46.52,37.59 49.06,37.54 55.91,31.72 57.96,31.74 55.88,30.17 57.94,30.17 62.38,29.71 62.31,27.35 45.01,4.03 46.39,4.06 50.65,8.65 50.68,6.93 49.71,6.6 49.59,8.53 48.6,7.94 48.01,7.03 47.96,6.01 47.5,4.08 47.96,4.92 49.64,5.61 49.66,4.64 49.66,3.52 48.29,2.18 49.23,2.61 20.88,4.62 22.13,3.8 30.84,9.34 32.03,9.39 30.97,6.34 35.79,6.78 38.76,6.9 41.36,6.98 35.87,4.14 38.87,4.36 41.36,4.29 35.95,1.34 38.97,1.42 41.64,1.49 20.5,1.34 22.99,1.11 25.56,1.09 28.07,1.09 32.06,0.88 4.86,12.94 6.61,12.94 12.35,15.63 7.17,15.09 11.33,15.83 11.94,19.21 13.62,19.24 6.86,23.16 8.43,25.96 10.39,25.93 9.75,22.3 12.34,22.38 14.73,22.3 14.73,24 17.04,27.15 20.09,27.25 17.24,24.82 19.83,24.82 17.19,22.96 20.01,22.96 22.45,27.25 24.71,27.18 27.05,27.2 29.28,27.25 22.35,25.04 25.19,25.07 22.48,23.11 26.44,25.58 44.09,30.89 42.49,30.89 46.63,31.32 48.08,31.29 49.83,31.29 46.81,34.44 49.45,34.31 55.98,34.24 57.88,34.37 53.85,34.39 53.82,31.44 59.86,35.71 59.81,34.34 59.92,31.67 59.86,30.07 22.91,31.5 22.7,30.25 7.79,34.16 10.28,34.16 10,32.41 11.81,32.41 12.54,34.14 66.01,36.19 66.01,35.18 66.77,34.34 68.68,34.8 68.68,32.13 67.54,32.38 66.14,32.51 65,33.15 64.11,34.16 63.85,35.31 66.01,37.46 65.88,29.34 67.92,29.46 67.03,30.73 67.92,26.92 66.14,26.29 68.81,24.51 68.81,28.57 66.9,27.69 67.03,23.75 67.41,25.15 68.04,22.22 68.68,23.24 61.44,19.05 63.22,18.29 64.23,19.43 65.25,18.16 66.27,18.41 69.06,18.54 62.2,17.14 64.36,17.02 40.1,8.38 41.37,9.91 45.56,5.59 45.56,6.98 48.1,9.24 48.41,14.1 46.83,6.98 15.47,33.53 16.48,34.67 18.01,34.42 17.37,32.89 18.64,33.02 7.21,37.59 9.37,37.59 11.66,37.59 14.45,37.59 16.48,37.46 18.39,26.03 31.72,21.08 33.37,21.08 35.79,23.24 46.83,5.46 40.36,3.05 37.18,2.67 6.99,4.57 5.36,8.43 4.47,5.28 2.57,2.18 4.6,1.16 12.76,0.96 16.69,1.24 14.46,9.49 14.51,7.36 17,9.52 19.97,6.27 18.14,2.08 14.74,1.52 2.59,36.6 1.65,35.53 1.17,33.78 9.09,34.54 14.91,34.49 41.78,21.38
  pour Top (rank 2): -1.99,40.85 70.41,40.44 70.3,10.87 70.22,-4.74 41.85,-4.8 -1.99,-4.9
  pour Bottom: -2.04,-4.85 50.94,-4.39 50.93,16.12 70.31,15.91 70.4,40.44 61.92,40.47 -2.04,40.85
GPIO_RESET  (via drill 0.33)
  Top 0.254: U1.40 38.82,13.07 38.3,12.55 32.27,12.55 29.68,9.96 29.68,9.65 v29.69,9.64 | Q7.3 29.65,2.13 v29.69,2.09
  Bottom 0.254: v29.69,2.09 v29.69,9.64
GPIO_STANDBY
  Top 0.254: U1.39 38.32,13.43 37.96,13.07 31.98,13.07 28.87,9.96 28.87,8.57 Q12.3
GPS_VCC
  Top 0.61: Q11.1 27.98,3.46 28.61,4.09 31.56,4.09 32.53,3.12 33.83,3.12 U3.8
INT  (via drill 0.33)
  Top 0.203: R27.1 v14.26,2.67 v14.27,2.65
  Top 0.254: U1.25 v35.82,21.95 v35.82,21.96
  Bottom 0.254: v35.82,21.96 17.4,21.96 15.74,20.29 15.74,3.61 14.8,2.67 v14.26,2.67
LED1  (via drill 0.33)
  Top 0.254: v22.98,17.88 15.64,17.88 14.44,16.69 R15.2 | v32.09,16.23 32.4,16.23 33.35,17.18 U1.33
  Bottom 0.254: v22.98,17.88 30.34,17.88 30.77,17.45 30.77,16.59 31.13,16.23 v32.09,16.23
LED2  (via drill 0.33)
  Top 0.254: v22.57,20.04 20.51,20.04 19.93,20.62 R3.2 | v31.08,20.04 33.44,20.04 34.3,19.18 U1.29
  Bottom 0.254: v22.57,20.04 v31.08,20.04
LED3  (via drill 0.33)
  Top 0.254: U1.32 32.53,17.68 v32.12,17.27 | v22.52,18.92 15.03,18.92 13.95,17.84 R4.2
  Bottom 0.254: v22.52,18.92 31.51,18.92 32.12,18.31 v32.12,17.27
MISO
  Top 0.254: U1.16 41.32,24.16 41.89,24.73 51.79,24.73 52.89,23.63 U4.2
MOSI
  Top 0.254: U1.17 40.82,24.42 41.64,25.24 53.95,25.24 54.89,24.29 U4.3
N$1
  Top 0.254: U1.5 45.59,17.68 45.93,18.02 45.93,18.86 46.28,19.22 R1.2 47.21,18.71 Q2.1
N$2
  Top 0.254: U1.6 45.07,18.18 45.37,18.48 45.37,19.29 46.21,20.13 R1.1 47.28,20.71 Q2.3
N$4
  Top 0.254: R9.2 18.13,31.29 CHRG.C
N$5
  Top 0.61: U10.3 32.94,29.59 L2.P$1
N$6
  Top 0.254: R15.1 9.46,16.69 9.13,17.02 STATUS.R-
N$7
  Top 0.254: R10.2 18,30.03 FAULT.C
N$8
  Top 0.813: Q4.2 29.32,33.02 28.12,31.83 R19.2
N$9
  Top 0.254: U1.4 45.83,17.18 46.06,16.95 C2.2 47.53,16.95 47.64,17.06 Q3.3
N$10
  Top 0.254: U5.7 R9.1
N$11
  Top 0.254: U5.6 R10.1
N$12
  Top 0.254: U1.3 45.34,16.68 45.52,16.5 45.52,16.02 45.88,15.66 C1.2 47.48,15.66 47.58,15.56 Q3.4
N$14
  Top 0.406: R16.2 Q13.1 arc-90 Q13.1
  Top 0.508: Q13.1 Q11.3
N$15
  Top 0.254: U5.1 6.58,32.56 | 6.58,32.56 6.54,32.52 R13.2 R17.1 | R12.1 6.54,32.61 6.58,32.56
N$16
  Top 0.254: U5.2 7.57,31.29 7.4,31.13 7.4,30.24 7.07,29.91 6.53,29.91 R11.2
N$17
  Top 0.254: K1.3 31.39,22.24 32.5,23.34 33.52,23.34 R2.2
  Top 0.61: K1.6 28.72,15.89 K1.4 K1.3
N$18
  Top 0.254: STATUS.B- R3.1
N$19
  Top 0.254: STATUS.G- 12.39,17.82 R4.1
N$20
  Top 0.254: C14.2 R5.1 | R5.1 R6.2 | U10.5 39.67,31.49 39.92,31.74 R5.1
N$21
  Top 0.406: U7.1 arc-90 58.23,7.77 50.23,7.77 arc90 48.81,6.35 48.81,3.96 arc-90 47.99,3.15 47.24,3.15 arc90 R8.2 arc-90 R8.2 C10.1
N$22
  Top 0.203: U2.22 10.38,7.44 10.61,7.67 10.83,7.67 11.49,8.33 R31.2
N$37
  Top 0.254: U3.18 R20.2
N$38
  Top 0.254: U3.17 R21.2
N$39
  Top 0.254: U3.16 R22.2
N$44
  Top 0.203: U2.9 10.38,3.48 9.89,3 8.68,3 8.02,2.34 R26.2
N$46
  Top 0.203: U2.10 10.78,3.22 10.1,2.54 9.39,2.54 9.13,2.28 C6.2
N$48
  Top 0.203: U2.11 11.18,2.58 10.5,1.9 R28.2
N$49
  Top 0.203: U2.12 11.58,2.81 11.72,2.67 R27.2
NSS  (via drill 0.33)
  Top 0.254: U1.38 37.82,15.29 v38.18,15.65 | U4.5 58.89,21.87 v58.9,22.55
  Bottom 0.254: v38.18,15.65 38.18,13.37 39.28,12.27 48.96,12.27 50.2,13.51 50.2,21.33 51.42,22.55 57.83,22.55 v58.9,22.55
PA0
  Top 0.254: R24.1 R23.1 46.93,21.74 45.36,20.18 U1.10
PA2
  Top 0.254: R23.2 46.01,22.02 45.17,21.18 U1.12
PB5  (via drill 0.33)
  Top 0.254: U1.41 39.32,12.72 38.57,11.96 32.81,11.96 v32.5,11.66 | v27.17,7.39 27.17,6.86 26.86,6.55 Q13.3
  Bottom 0.254: v32.5,11.66 27.73,11.66 27.17,11.1 v27.17,7.39
PB14
  Top 0.254: U1.27 35.02,20.18 34.8,20.4 34.8,22.23 34.44,22.59 R2.1 | R2.1 | C7.2 R2.1
RESET
  Top 0.254: U3.9 31.7,2.03 Q7.1
RF  (via drill 0.8)
  Top 0.508: U4.9 64.89,35.48 arc90 66.94,33.43 v68.75,33.43
RF_IN
  Top 0.406: U3.11 arc90 U3.11 R8.1 arc90 R8.1 C9.1
RF_RESET
  Top 0.254: U1.18 40.32,24.76 41.36,25.79 59.84,25.79 60.89,24.74 U4.6
RST  (via drill 0.33)
  Top 0.254: U1.7 v38.35,18.68 v38.34,18.68 | RST.P$1 3.33,9.49 4.54,10.69 v28.08,10.69
  Bottom 0.254: v38.34,18.68 34.74,18.68 33.62,17.55 33.62,11.15 33.16,10.69 v28.08,10.69
RXD_MODULE  (via drill 0.33)
  Top 0.254: U1.42 39.82,11.67 39.03,10.87 v36.67,10.87 | v36.67,8.63 U3.3
  Bottom 0.254: v36.67,10.87 v36.67,8.63
SCK  (via drill 0.33)
  Top 0.254: U1.15 41.82,23.47 42.2,23.84 v43.74,23.84 | U4.4 56.89,23.75 v56.8,23.84
  Bottom 0.254: v43.74,23.84 v56.8,23.84
SCL  (via drill 0.33)
  Top 0.203: U2.23 9.98,7.86 10.2,8.08 10.56,8.08 10.81,8.33 v10.81,9.3
  Top 0.254: U1.30 30.91,18.68 30.21,17.98 30.21,14.78 29.66,14.22 15.13,14.22 v14.92,14.43 | R14.1 10.68,9.42 v10.81,9.3
  Bottom 0.254: v14.92,14.43 14.92,13.38 14.49,12.95 12.23,12.95 10.81,11.53 v10.81,9.3
SDA  (via drill 0.33)
  Top 0.203: R7.1 9.59,8.38 | 9.59,8.38 9.62,8.38 v9.95,8.71 | U2.24 9.58,8.37 9.59,8.38
  Top 0.254: U1.31 32.01,18.18 31.33,17.5 31.33,15.04 29.83,13.54 13.98,13.54 v13.86,13.66
  Bottom 0.254: v13.86,13.66 11.42,13.66 9.95,12.19 v9.95,8.71
STANDBY
  Top 0.254: U3.5 33.08,6.43 31.9,7.61 Q12.1
SWCLK
  Top 0.254: J2.P3 6.81,19.23 7.18,18.86 7.18,16.3 8.07,15.42 9.21,15.42 9.47,15.16 9.47,14.83 | 9.47,14.83 9.47,13.99 | D2.P$2 9.4,14.86 arc-45 9.47,14.83 | R29.2 9.34,13.94 arc45 9.47,13.99 | 9.47,13.99 9.47,13.03 10.15,12.34 30.42,12.34 31.69,13.61 36.76,13.61 U1.37
SWDIO
  Top 0.254: J2.P2 7.27,19.89 7.83,19.33 7.83,16.62 8.4,16.05 9.51,16.05 10.1,15.47 10.1,14.91 | 10.1,14.91 10.1,13.92 | 10.1,13.92 10.1,13.26 10.43,12.93 30.11,12.93 33.86,16.68 U1.34 | D3.P$2 10.19,14.87 arc-45 10.1,14.91 | R30.1 10.1,13.91 10.1,13.92
TXD_MODULE
  Top 0.254: U1.43 40.32,11.2 38.86,9.73 U3.2
UGND
  Top 0.406: J2.P5 5.17,17.91 5.79,17.29 5.79,14.5 L4.2
USB_5V
  Top 0.254: C20.1 C19.+ | FAULT.A CHRG.A | 17.94,35.96 17.9,36 | CHRG.A 19.64,35.76 19.88,36
  Top 0.305: U5.8 13.85,35.8 13.65,36
  Top 0.406: DD2.A R18.2 Q4.3 | R12.2 5.62,35.28 5.53,35.38
  Top 0.61: CHRG.A | 12.15,35.93 12.21,36
  Top 0.813: 6.51,27.22 C16.1 7.25,28.54 7.46,28.75 U5.4 | 6.51,27.22 6.51,25.94 C19.+ | F1.1 11.91,26.75 11.45,27.22 6.51,27.22 | 6.51,27.22 3.77,27.22 2.94,28.04 2.94,32.8 5.53,35.38 6.14,36 12.21,36 13.65,36 17.9,36 19.88,36 26.91,36 27.71,36.8 DD2.A
XUSB
  Top 0.406: J2.P1 6.17,20.55 6.39,20.78
  Top 0.61: F1.2 8.49,22.88 6.39,20.78

### Text on the board
tPlace: J2
bPlace: 433MHZ | 470MHZ | 868MHZ | 915/920
tDocu: LoRa GPS Track V1.2